# Altium schematic sheet 2_transmitter.SchDoc
size A; SheetNumber: 2; SheetTotal: 8
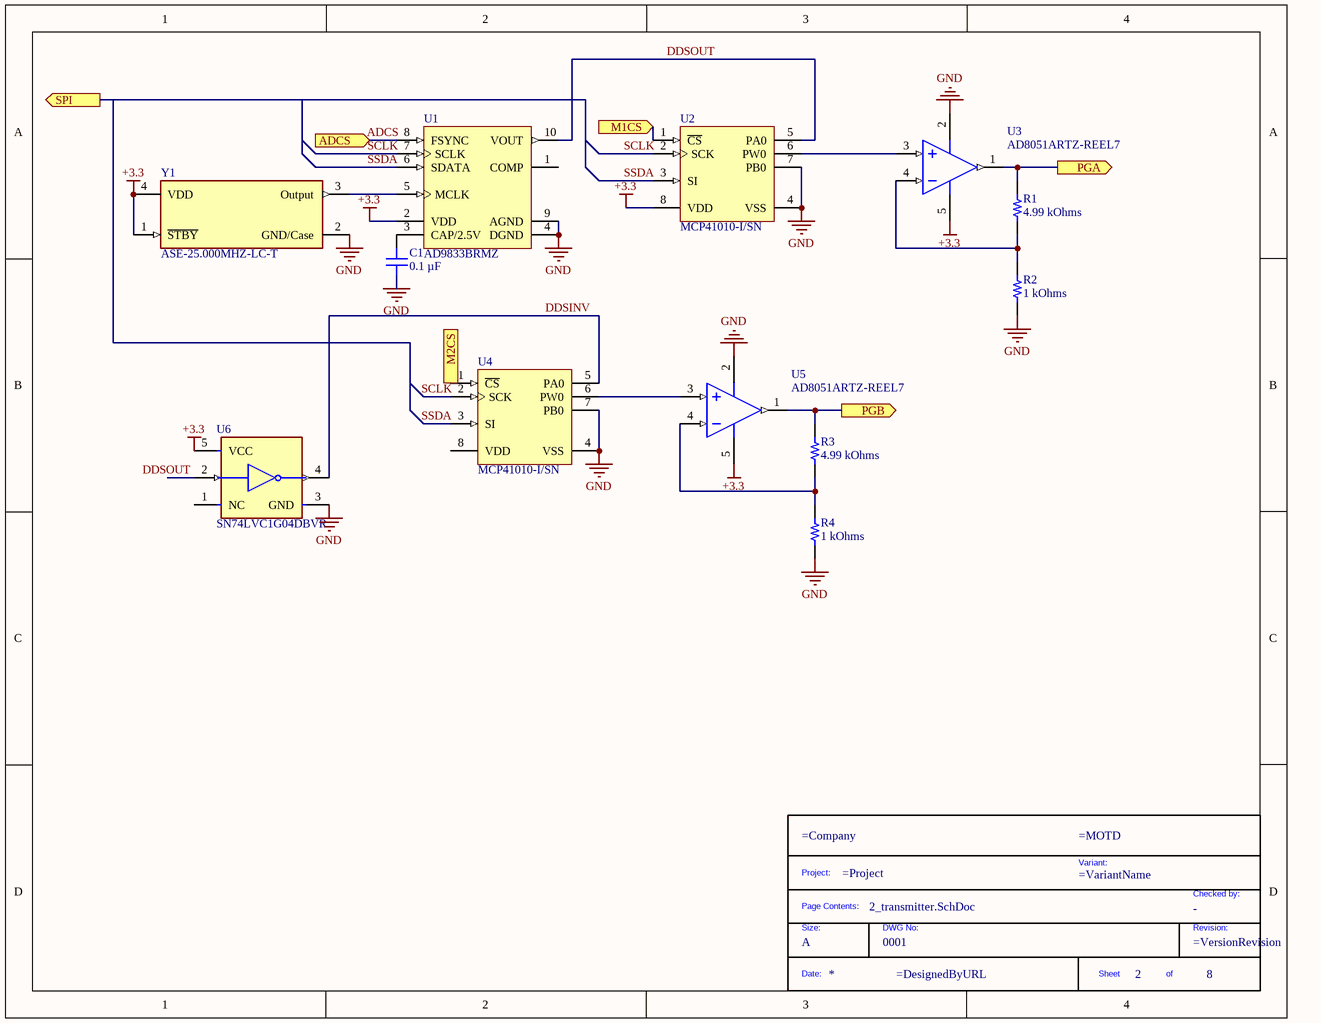
[diagram p0: 2_transmitter.SchDoc]

## Parts
*?  DWG No: 0001  Size: A  (hidden comment: TitleBlock)  (graphical)
C1  0.1 µF  [CAP 1210_3225 - 1MM]
R1  4.99 kOhms  [RES 0805_2012]
R2  1 kOhms  [RES 0805_2012]
R3  4.99 kOhms  [RES 0805_2012]
R4  1 kOhms  [RES 0805_2012]
U1  AD9833BRMZ  [ADI-RM-10_N]
U2  MCP41010-I/SN  [SOIC-SN8_M]
U3  AD8051ARTZ-REEL7  [ADI-RJ-5_N]
U4  MCP41010-I/SN  [SOIC-SN8_M]
U5  AD8051ARTZ-REEL7  [ADI-RJ-5_N]
U6  SN74LVC1G04DBVR  [FP-DBV0005A-MFG]
Y1  ASE-25.000MHZ-LC-T  [FP-ASE-MFG]

## Ports
ADCS (in), M1CS (in), M2CS (in), PGA (out), PGB (out), SPI (out)

## Nets
+3.3: U1.2(VDD) U2.8(VDD) U3.5(+VS) U5.5(+VS) U6.5(VCC) Y1.1(~{STBY}) Y1.4(VDD)
GND: C1.1 R2.1 R4.1 U1.4(DGND) U1.9(AGND) U2.4(VSS) U2.7(PB0) U3.2(-VS) U4.4(VSS) U4.7(PB0) U5.2(-VS) U6.3(GND) Y1.2(GND/Case)
ADCS: U1.8(FSYNC) ; port ADCS
DDSINV: U4.5(PA0) U6.4(Y)
DDSOUT: U1.10(VOUT) U2.5(PA0) U6.2(A)
M1CS: U2.1(~{CS}) ; port M1CS
M2CS: U4.1(~{CS}) ; port M2CS
PGA: R1.2 U3.1(VOUT) ; port PGA
PGB: R3.2 U5.1(VOUT) ; port PGB
SCLK: U1.7(SCLK) U2.2(SCK) U4.2(SCK)
SSDA: U1.6(SDATA) U2.3(SI) U4.3(SI)
NetC1_2: C1.2 U1.3(CAP/2.5V)
NetR1_1: R1.1 R2.2 U3.4(-IN)
NetR3_1: R3.1 R4.2 U5.4(-IN)
NetU1_5: U1.5(MCLK) Y1.3(Output)
NetU2_6: U2.6(PW0) U3.3(+IN)
NetU4_6: U4.6(PW0) U5.3(+IN)

Not connected (* = marked no-connect by the designer): U1 1(COMP); U4 8(VDD); U6 1(NC)

## Notes on the sheet
- (in symbol TitleBlock) Project:; Variant:; Checked by:; Page Contents:; Size:; DWG No:; Revision:; Date:; Sheet; of

## Library data of the parts
*? = TitleBlock: Standard Title Block; Checked by: -
C1 = CGA6L1X7T2J104K160AC: CAP CER 0.1UF 630V X7T 1210; manufacturer: TDK Corporation; Tolerance: ±10%; Part Number: CGA6L1X7T2J104K160AC; Value: 0.1 µF; Applications: Automotive; Capacitance: 0.1 µF; componentlink1description: Datasheet; componentlink1url: https://product.tdk.com/info/en/catalog/datasheets/mlcc_automotive_midvoltage_en.pdf?ref_disty=digikey; componentlink2description: DigiKey Link; componentlink2url: https://www.digikey.com/en/products/detail/tdk-corporation/CGA6L1X7T2J104K160AC/2679652; Device Package: 1210 (3225 Metric); lastupdated: 2022-09-19 13:23:34; Lifecycle Status: Active; Minimum Order: 1; Mounting Type: Surface Mount, MLCC; Operating Temperature: -55°C ~ 125°C; Package / Case: 1210 (3225 Metric); packaging: TapeAndReel; partid: 26002; Part Status: Active; price: 0.16; Ratings: AEC-Q200; series: CGA; Size / Dimension: 0.126" L x 0.098" W (3.20mm x 2.50mm); Supplier 1: DigiKey; Supplier Part Number 1: 445-7116-1-ND; Temperature Coefficient: X7T; Thickness (Max): 0.075" (1.90mm); Voltage - Rated: 630V
R1 R3 = CRCW08054K99FKEAC: RES 4.99K OHM 1% 1/8W 0805; Manufacturer: Vishay Dale; Power (Watts): 0.125W, 1/8W; Temperature Coefficient: ±100ppm/°C; Part Number: CRCW08054K99FKEAC; Value: 4.99 kOhms; ComponentLink1Description: Datasheet; ComponentLink1URL: http://www.vishay.com/docs/28773/crcwce3.pdf; ComponentLink2Description: DigiKey Link; ComponentLink2URL: https://www.digikey.com/en/products/detail/vishay-dale/CRCW08054K99FKEAC/7928560; Composition: Thick Film; Device Package: 0805 (2012 Metric); Height - Seated (Max): 0.024" (0.60mm); LastUpdated: 2022-09-19 13:35:51; Lifecycle Status: Active; Minimum Order: 1; Number of Terminations: 2; Operating Temperature: -55°C ~ 155°C; Package / Case: 0805 (2012 Metric); Packaging: TapeAndReel; PartId: 46240; Part Status: Active; Price: 0.01; Resistance: 4.99 kOhms; Series: CRCW-C; Size / Dimension: 0.079" L x 0.049" W (2.00mm x 1.25mm); Supplier 1: DigiKey; Supplier Part Number 1: 541-4138-1-ND; Supplier Device Package: 0805; Tolerance: ±1%
R2 R4 = RC0805FR-131KL: RES 1K OHM 1% 1/8W 0805; Manufacturer: Yageo; Power (Watts): 0.125W, 1/8W; Temperature Coefficient: ±100ppm/°C; Part Number: RC0805FR-131KL; Value: 1 kOhms; ComponentLink1Description: Datasheet; ComponentLink1URL: https://www.yageo.com/upload/media/product/productsearch/datasheet/rchip/PYu-RC_Group_51_RoHS_L_11.pdf; ComponentLink2Description: DigiKey Link; ComponentLink2URL: https://www.digikey.com/en/products/detail/yageo/RC0805FR-131KL/13694082; Composition: Thick Film; Device Package: 0805 (2012 Metric); Features: Moisture Resistant; Height - Seated (Max): 0.024" (0.60mm); LastUpdated: 2022-09-19 13:35:02; Lifecycle Status: Active; Minimum Order: 1; Number of Terminations: 2; Operating Temperature: -55°C ~ 155°C; Package / Case: 0805 (2012 Metric); Packaging: CutTape; PartId: 66357; Part Status: Active; Price: 0.01; Resistance: 1 kOhms; Series: RC_L; Size / Dimension: 0.079" L x 0.049" W (2.00mm x 1.25mm); Supplier 1: DigiKey; Supplier Part Number 1: 13-RC0805FR-131KLCT-ND; Supplier Device Package: 0805; Tolerance: ±1%
U1 = CMP-0293-00077-1: Low Power, 12.65 mW, 2.3 V to 5.5 V, Programmable Waveform Generator, 10-Bit, Serial, RM-10, 50 Tube, Pb-Free; Resolution (Bits): 10bit; Compliance Range (V): 650mV; FS Iout (mA nom): 3mA; REFCLK Multiplier: No; Master fclk: 25MHz; I Supply total (max): 5.5mA; Tuning Word Width (bits): 28bit; Code_JEDEC: MO-187-BA; DatasheetVersion: Rev. D; PackageVersion: 5/8/2005; ComponentLink1URL: www.analog.com; ComponentLink3Description: Package Specification; PackageDescription: 10-Lead Mini Small Outline Package [MSOP]; I/O Interface: Serial; ComponentLink2Description: Datasheet; ComponentLink1Description: Manufacturer URL; PackageReference: RM-10; ComponentLink2URL: http://www.analog.com/static/imported-files/data_sheets/AD9833.pdf; ComponentLink3URL: http://www.analog.com/static/imported-files/packages/PKG_PDF/MSOP%28RM%29/RM_10.pdf
U2 U4 = CMP-0188-00462-2: Single/Dual Digital Potentiometer with SPI Interface, 8-Pin SOIC 150mil, Industrial Temperature; Code_IPC: SOIC127P600-8; ComponentLink3Description: Package Specification; ComponentLink2URL: http://ww1.microchip.com/downloads/en/DeviceDoc/11195c.pdf; PackageReference: SOIC-SN8; ComponentLink2Description: Datasheet; PackageVersion: revBB, Aug-2009; PackageDescription: 8-Lead Plastic Small Outline (SN) - Narrow, 3.90mm Body [SOIC]; DatasheetVersion: Jul-2003; ComponentLink1URL: http://www.microchip.com/; Code_JEDEC: MS-012; ComponentLink3URL: http://www.microchip.com/stellent/groups/techpub_sg/documents/packagingspec/en012702.pdf; ComponentLink1Description: Manufacturer URL; RevisionNote: URLs added.
U3 U5 = CMP-0384-01453-2: Single Channel Single-Supply Operation Operational Amplifier, 110 MHz BW, 170 V/us SR, Industrial, 5-pin SOT23 (RJ-5), Reel; Generic Part Number: AD8051; Manufacturer: Analog Devices; V Span Max: 12V; Input Bias Current: 1.4uA; Iq/Amp: 5.5mA; Input Offset Voltage: 1.7mV; Small Signal Bandwidth: 110MHz; V Span Min: 3V; Amplifiers Per Package: 1; PackageDescription: 5-Pin Small Outline Transistor Package, Body 2.9 x 1.6 mm, Pitch 0.95 mm; PartNumber: AD8051ARTZ-REEL7; ComponentLink2Description: Datasheet; ComponentLink1Description: Manufacturer URL; Mounting Technology: Surface Mount; ComponentLink1URL: http://www.analog.com/en/index.html; PackageVersion: 121608-A; ComponentLink3Description: Package Specification; Code_JEDEC: MO-178-AA; ComponentLink2URL: http://www.analog.com/static/imported-files/data_sheets/AD8051_8052_8054.pdf; PackageReference: RJ-5; RevisionNote: Symbol corrected, Pin 2 orientation reversed; DatasheetVersion: Rev. J; ComponentLink3URL: http://www.analog.com/static/imported-files/packages/PKG_PDF/SOT-23(RJ)/RJ_5.pdf; Slew Rate: 170V/us; Packing: Reel
U6 = CMP-0859-00134-4: IC INVERTER 1CH 1-INP SOT23-5; Number of Elements: 1; Turn-On Delay Time: 7.5ns; Propagation Delay: 3.7ns; Max Supply Voltage: 5.5V; Max Output Current: 32mA; Quiescent Current: 10uA; High Level Output Current: -32mA; Schmitt Trigger Input: No; Min Supply Voltage: 1.65V; Number of Circuits: 1; Lead Free: Lead Free; Number of Inputs: 1; Mount: Surface Mount; Length: 3.05mm; Width: 1.75mm; Number of Pins: 5; Case/Package: SOT-23; REACH SVHC: No SVHC; Low Level Output Current: 32mA; Package Quantity: 1; Height: 1.3mm; Radiation Hardening: No; Packaging: Tape and Reel; Output Current: 32mA; Max Operating Temperature: 125°C; Termination: SMD/SMT; Min Operating Temperature: -40°C; Number of Gates: 1; Weight: 0.000557oz; Logic Function: Inverter; Number of Bits: 1; Contact Plating: Tin
Y1 = CMP-2000-05795-3: XTAL Oscillator 25MHz ±50ppm CMOS 3.3V 4-SMD 3.2mm x 2.5mm; Load Capacitance: 15pF; Min Supply Voltage: 3.135V; Max Supply Voltage: 3.465V; Max Supply Current: 13mA; Max Operating Temperature: 85°C; Termination: SMD/SMT; Operating Frequency: 25 MHz; Height: 0.047inch; Frequency: 25MHz; Mount: Surface Mount; Number of Pins: 4; Length: 3.2mm; Packaging: Tape and Reel; Frequency Stability: 50ppm; Series: ASE; Radiation Hardening: No; Package Quantity: 1000; Width: 2.5mm; Min Operating Temperature: -40°C; Lead Free: Lead Free; Case/Package: SMD/SMT; Depth: 2.5mm; Operating Supply Voltage: 3.3V